# EAGLE schematic efi-shield (EAGLE 7.3.0)

## Sheet 1 of 6: CONNECTORS & SPI
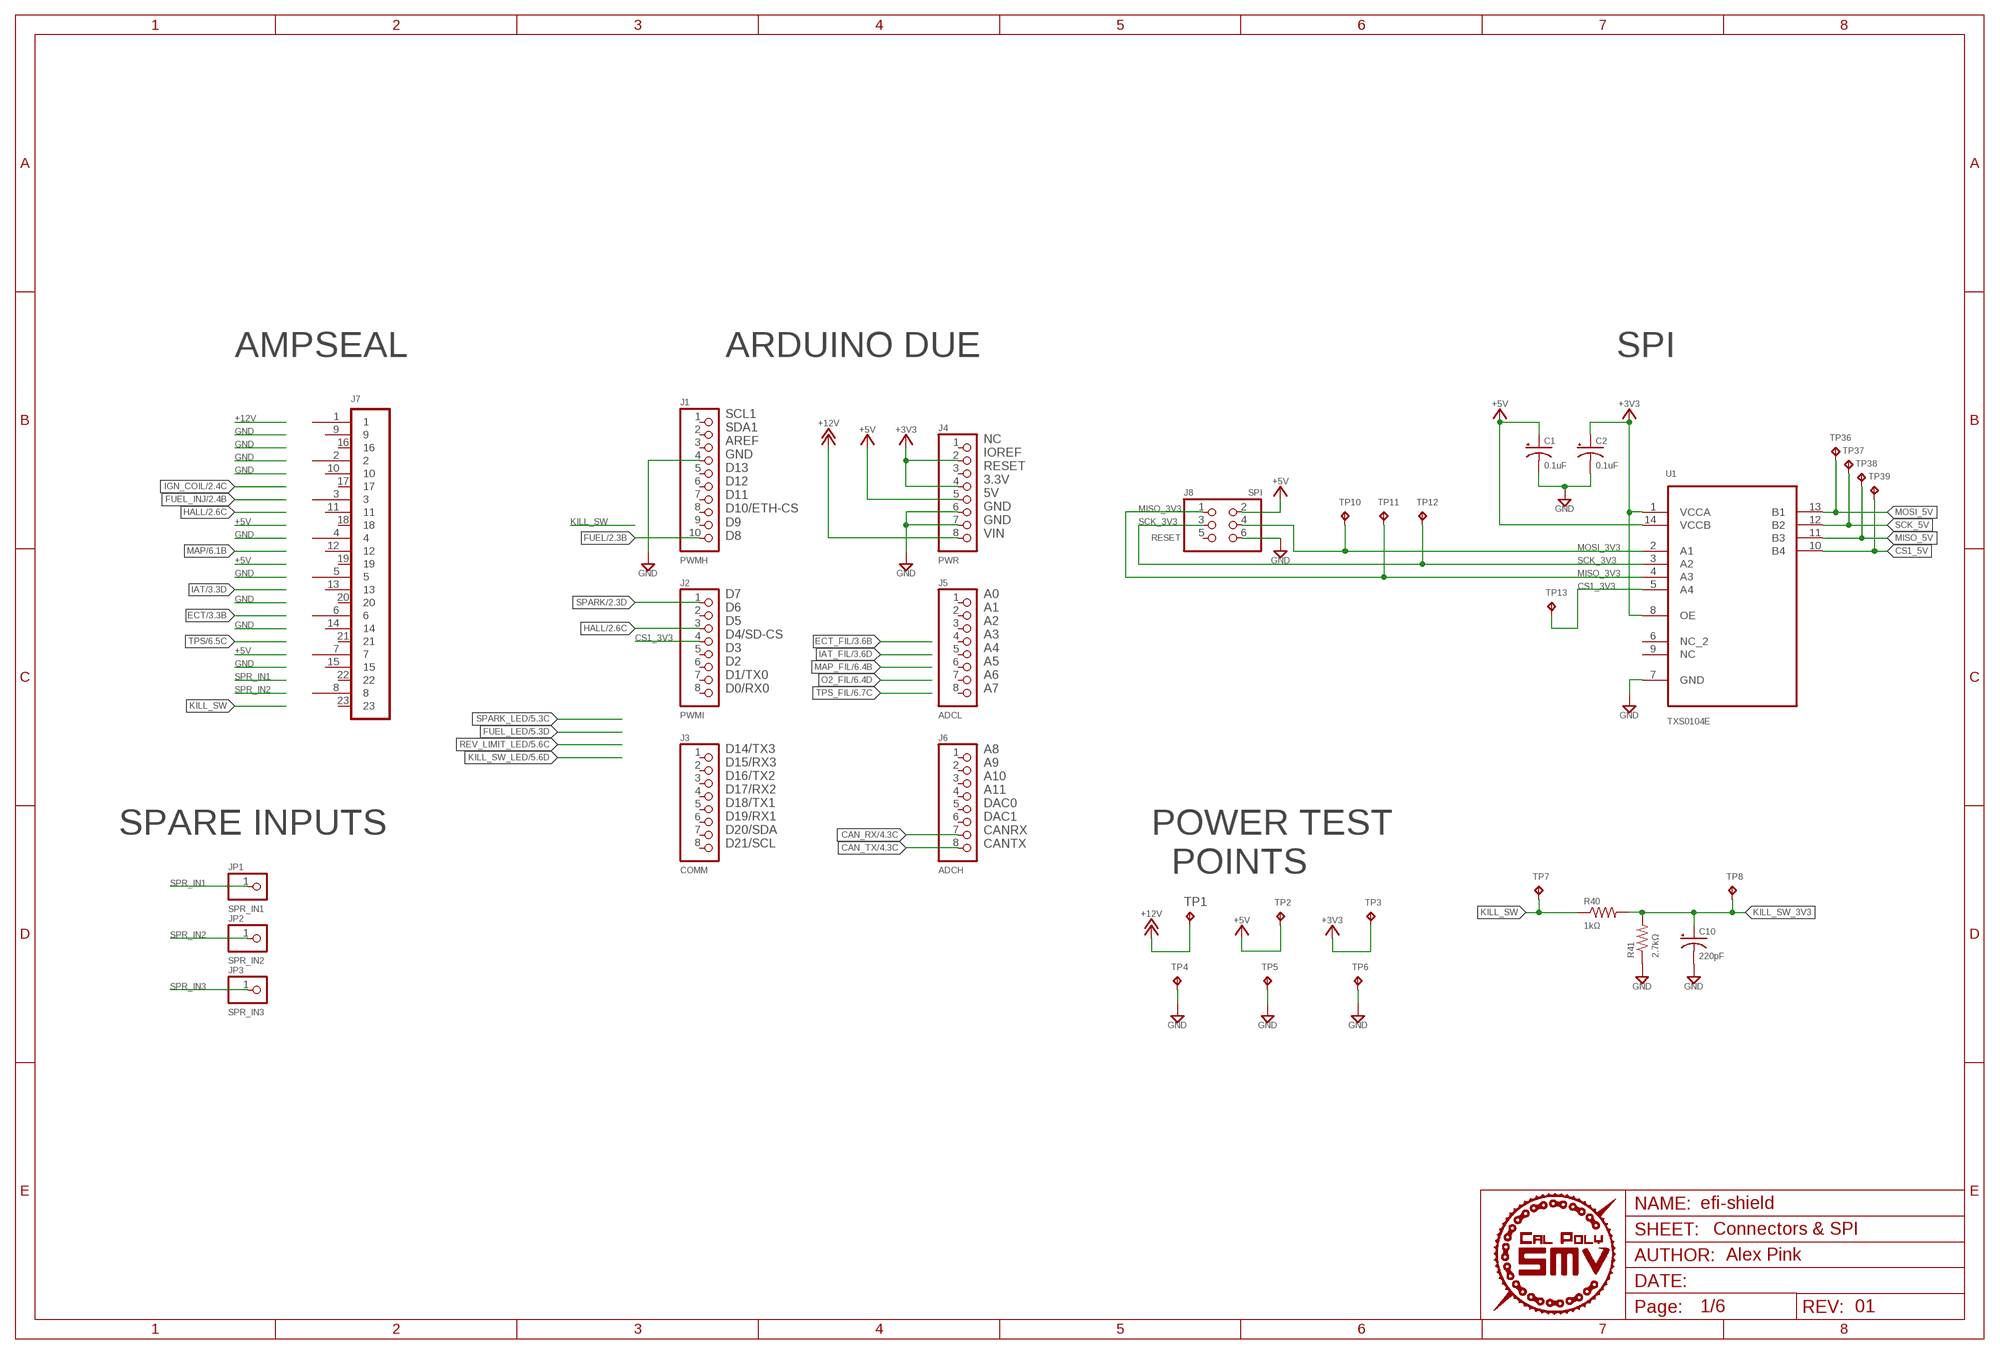
[diagram p0: schematic, sheet 1]

### Parts
C1  0.1uF  CAP-JKE  [C050-025X075]
C2  0.1uF  CAP-JKE  [C050-025X075]
C10  220pF  CAP-JKE  [C050-025X075]
J1  PWMH  PINHD-1X10  [1X10]
J2  PWMI  PINHD-1X8  [1X08]
J3  COMM  PINHD-1X8  [1X08]
J4  PWR  PINHD-1X8  [1X08]
J5  ADCL  PINHD-1X8  [1X08]
J6  ADCH  PINHD-1X8  [1X08]
J7  AMPSEAL-23POS-HEADER  [AMPSEAL-HEADER-23POS-RA]
J8  SPI  PINHD-2X3  [2X03]
JP1  SPR_IN1  PINHD-1X1  [1X01]
JP2  SPR_IN2  PINHD-1X1  [1X01]
JP3  SPR_IN3  PINHD-1X1  [1X01]
R40  1kΩ  RES-JKE  [0207/7]
R41  2.7kΩ  RES-JKE  [0207/7]
TP1  +12V  TEST-POINT  [TP-P1-20]
TP2  +5V  TEST-POINT  [TP-P1-20]
TP3  +3V3  TEST-POINT  [TP-P1-20]
TP4  GND  TEST-POINT  [TP-P1-20]
TP5  GND  TEST-POINT  [TP-P1-20]
TP6  GND  TEST-POINT  [TP-P1-20]
TP7  KILL_SW  TEST-POINT  [TP-P1-20]
TP8  KILL_SW_3V3  TEST-POINT  [TP-P1-20]
TP10  MOSI_3V3  TEST-POINT  [TP-P1-20]
TP11  MISO_3V3  TEST-POINT  [TP-P1-20]
TP12  SCK_3V3  TEST-POINT  [TP-P1-20]
TP13  CS1_3V3  TEST-POINT  [TP-P1-20]
TP36  MOSI_5V  TEST-POINT  [TP-P1-20]
TP37  SCK_5V  TEST-POINT  [TP-P1-20]
TP38  MISO_5V  TEST-POINT  [TP-P1-20]
TP39  CS1_5V  TEST-POINT  [TP-P1-20]
U1  TXS0104E  TXS0104ED  [SOIC127P600X175-14N]

### Nets
+3V3: C2.1 J4.2 J4.4 TP3.TP U1.1(VCCA) U1.8(OE)
+5V: C1.1 J4.5 J8.2 TP2.TP U1.14(VCCB) ; also sheet 2,3,4,5,6
+12V: J4.8 TP1.TP ; also sheet 4
CAN_RX: J6.7 ; also sheet 4
CAN_TX: J6.8 ; also sheet 4
CS1_3V3: J2.4 TP13.TP U1.5(A4)
CS1_5V: TP39.TP U1.10(B4)
FUEL: J1.10 ; also sheet 2
GND: C1.2 C2.2 C10.2 J1.4 J4.6 J4.7 J8.6 R41.1 TP4.TP TP5.TP TP6.TP U1.7(GND) ; also sheet 2,3,4,5,6
HALL: J2.3 ; also sheet 2
KILL_SW: R40.1 TP7.TP
KILL_SW_3V3: C10.1 R40.2 R41.2 TP8.TP
MISO_3V3: J8.1 TP11.TP U1.4(A3)
MISO_5V: TP38.TP U1.11(B3)
MOSI_3V3: J8.4 TP10.TP U1.2(A1)
MOSI_5V: TP36.TP U1.13(B1)
SCK_3V3: J8.3 TP12.TP U1.3(A2)
SCK_5V: TP37.TP U1.12(B2)
SPARK: J2.1 ; also sheet 2
SPR_IN1: JP1.1
SPR_IN2: JP2.1
SPR_IN3: JP3.1
Unconnected: J1.1 J1.2 J1.3 J1.5 J1.6 J1.7 J1.8 J1.9 J2.2 J2.5 J2.6 J2.7 J2.8 J3.1 J3.2 J3.3 J3.4 J3.5 J3.6 J3.7 J3.8 J4.1 J4.3 J5.1 J5.2 J5.3 J5.4 J5.5 J5.6 J5.7 J5.8 J6.1 J6.2 J6.3 J6.4 J6.5 J6.6 J7.1 J7.2 J7.3 J7.4 J7.5 J7.6 J7.7 J7.8 J7.9 J7.10 J7.11 J7.12 J7.13 J7.14 J7.15 J7.16 J7.17 J7.18 J7.19 J7.20 J7.21 J7.22 J7.23 J8.5 U1.6(NC_2) U1.9(NC)

### Notes on the sheet
- AMPSEAL | ARDUINO DUE | SPI
- SCL1
  SDA1
  AREF
  GND
  D13
  D12
  D11
  D10/ETH-CS
  D9
  D8
- NC
  IOREF
  RESET
  3.3V
  5V
  GND
  GND
  VIN
- RESET
- D7
  D6
  D5
  D4/SD-CS
  D3
  D2
  D1/TX0
  D0/RX0
- A0
  A1
  A2
  A3
  A4
  A5
  A6
  A7
- A8
  A9
  A10
  A11
  DAC0
  DAC1
  CANRX
  CANTX
- SPARE INPUTS
- D14/TX3
  D15/RX3
  D16/TX2
  D17/RX2
  D18/TX1
  D19/RX1
  D20/SDA
  D21/SCL
- POWER TEST
    POINTS
- Connectors & SPI
- Alex Pink
- 01

## Sheet 2 of 6: ACTUATORS + TACH
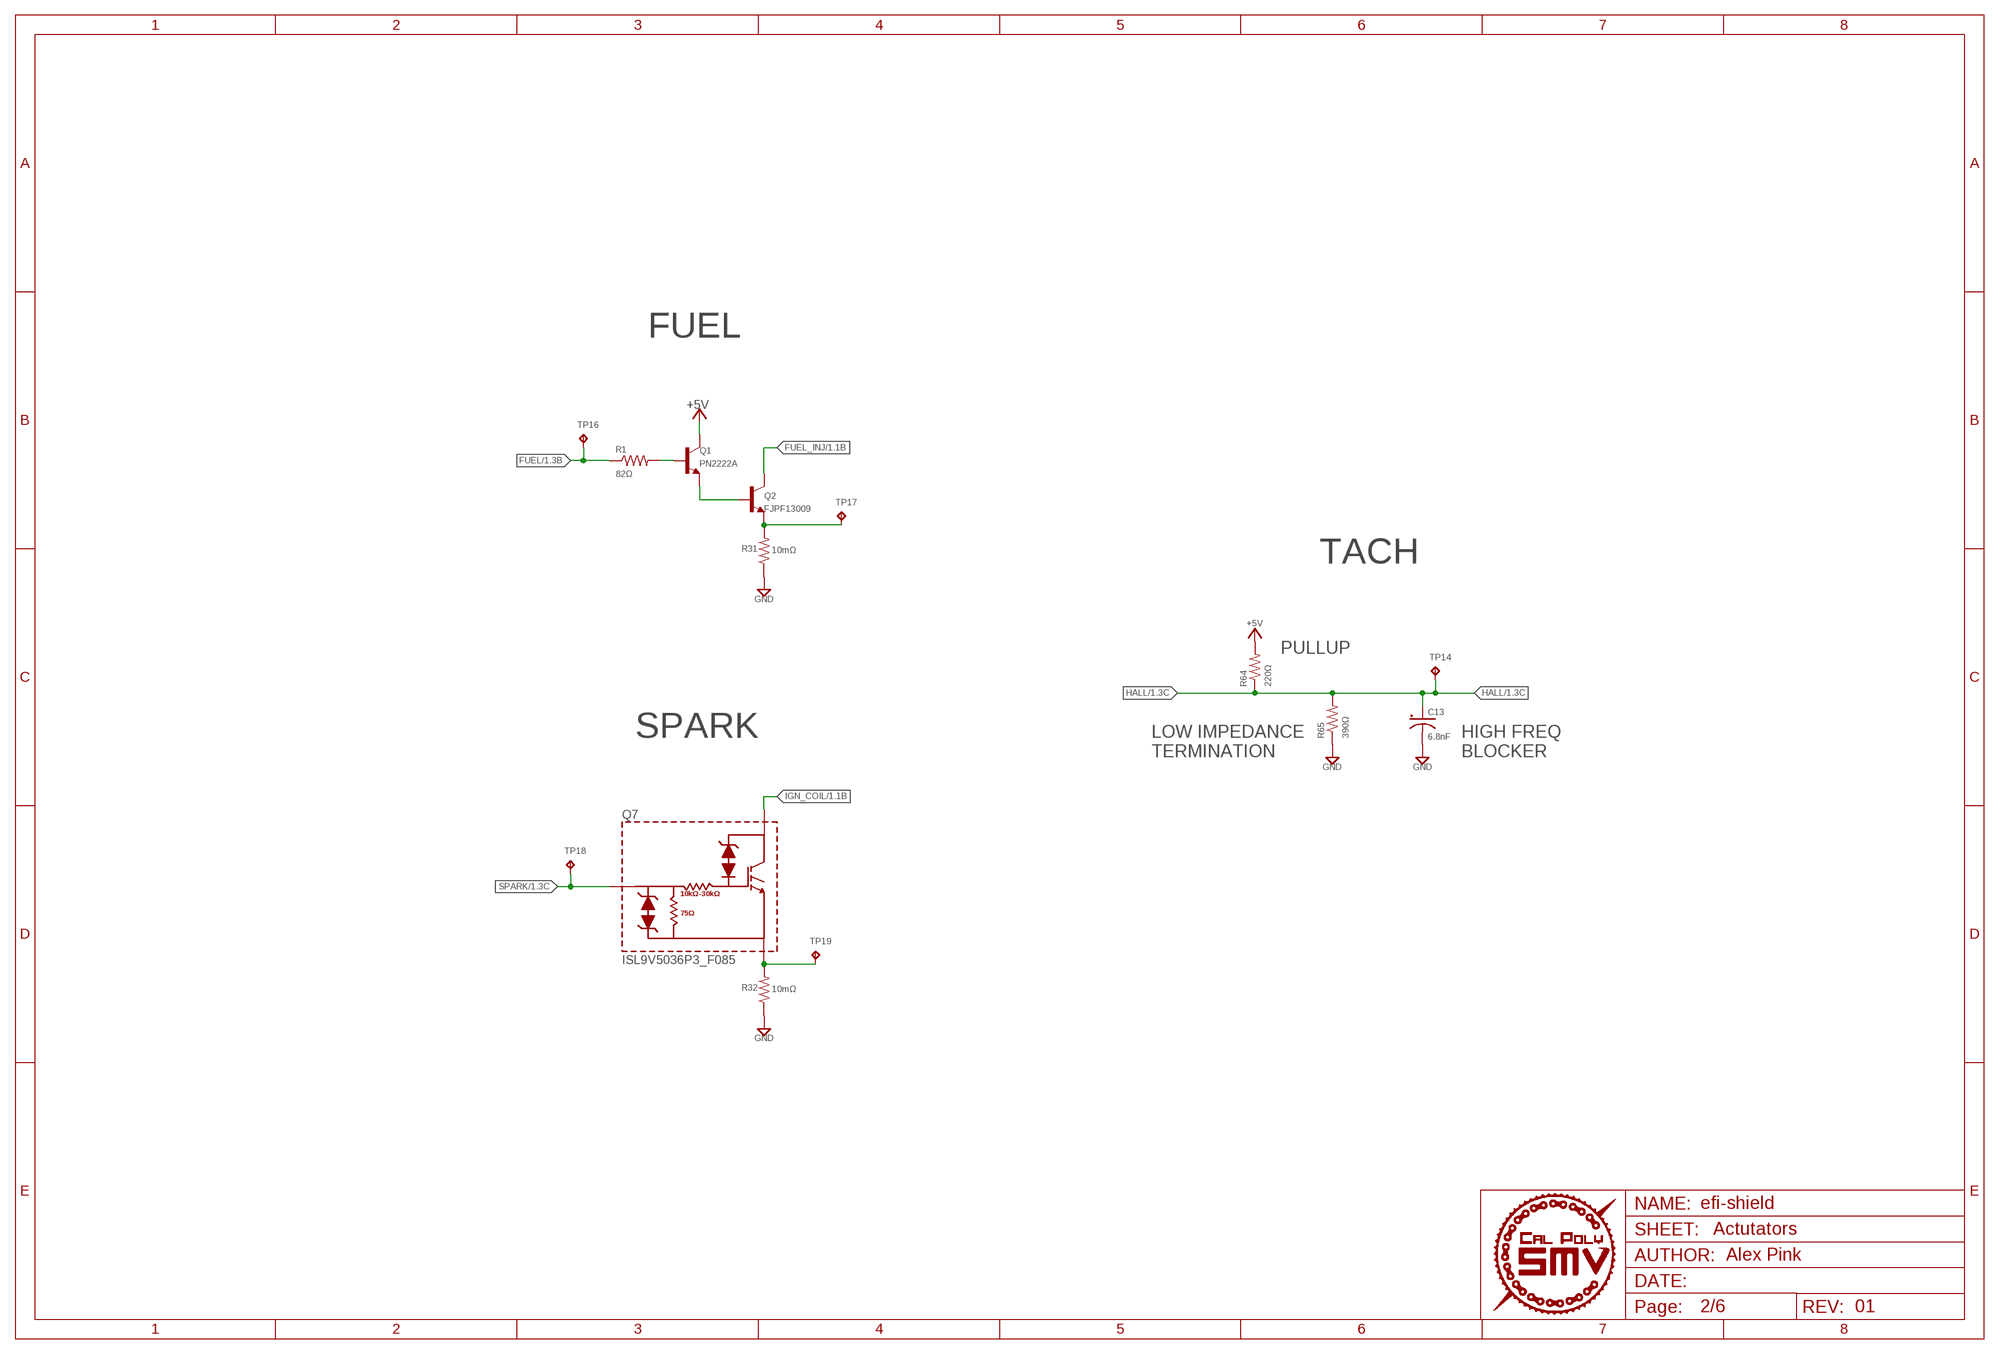
[diagram p1: schematic, sheet 2]

### Parts
C13  6.8nF  CAP-JKE  [C050-025X075]
Q1  PN2222A  [TO92-EBC]
Q2  FJPF13009  [TO220]
Q7  ISL9V5036P3_F085  [TO220AB]
R1  82Ω  RES-JKE  [0207/7]
R31  10mΩ  VISHAY_DALE-LVR03R0100FE70  [0514/15]
R32  10mΩ  VISHAY_DALE-LVR03R0100FE70  [0514/15]
R64  220Ω  RES-JKE  [0207/7]
R65  390Ω  RES-JKE  [0207/7]
TP14  HALL  TEST-POINT  [TP-P1-20]
TP16  FUEL  TEST-POINT  [TP-P1-20]
TP17  FUEL_E  TEST-POINT  [TP-P1-20]
TP18  SPARK  TEST-POINT  [TP-P1-20]
TP19  SPARK_E  TEST-POINT  [TP-P1-20]

### Nets
+5V: Q1.C R64.2 ; also sheet 1,3,4,5,6
FUEL: R1.1 TP16.TP ; also sheet 1
FUEL_INJ: Q2.2(C) ; also sheet 1
GND: C13.2 R31.1 R32.1 R65.1 ; also sheet 1,3,4,5,6
HALL: C13.1 R64.1 R65.2 TP14.TP ; also sheet 1
IGN_COIL: Q7.2(C) ; also sheet 1
N$1: Q1.B R1.2
N$3: Q1.E Q2.1(B)
N$38: Q7.3(E) R32.2 TP19.TP
N$39: Q2.3(E) R31.2 TP17.TP
SPARK: Q7.1(G) TP18.TP ; also sheet 1

### Notes on the sheet
- FUEL
- TACH
- PULLUP
- SPARK
- LOW IMPEDANCE
  TERMINATION
- HIGH FREQ
  BLOCKER
- Actutators
- Alex Pink
- 01

## Sheet 3 of 6: THERMISTORS
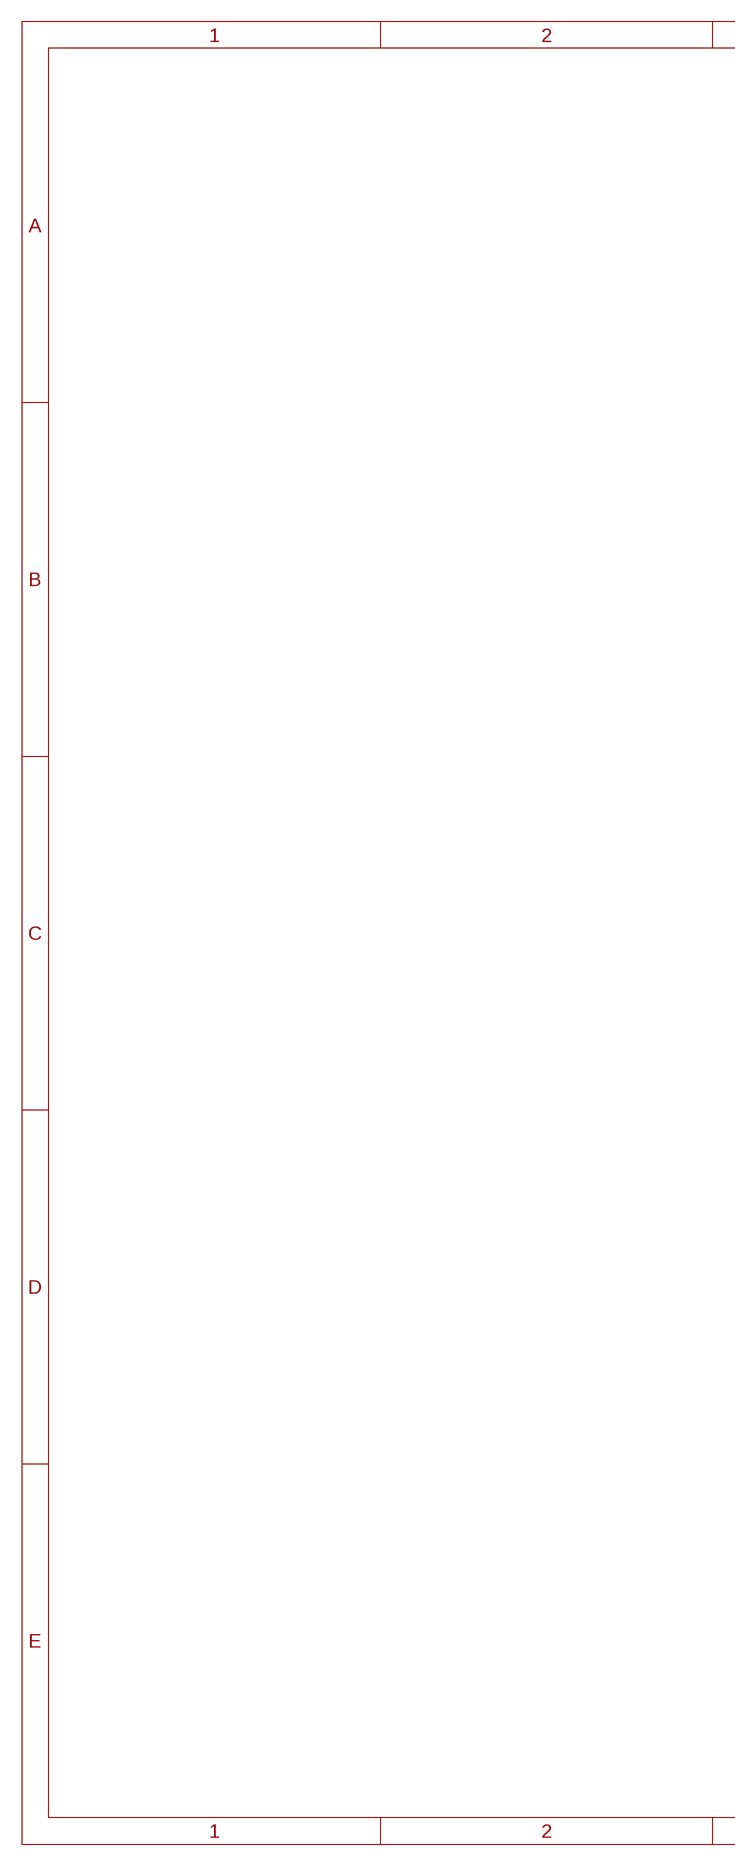
[diagram p2: schematic, sheet 3, part 1 of 2]
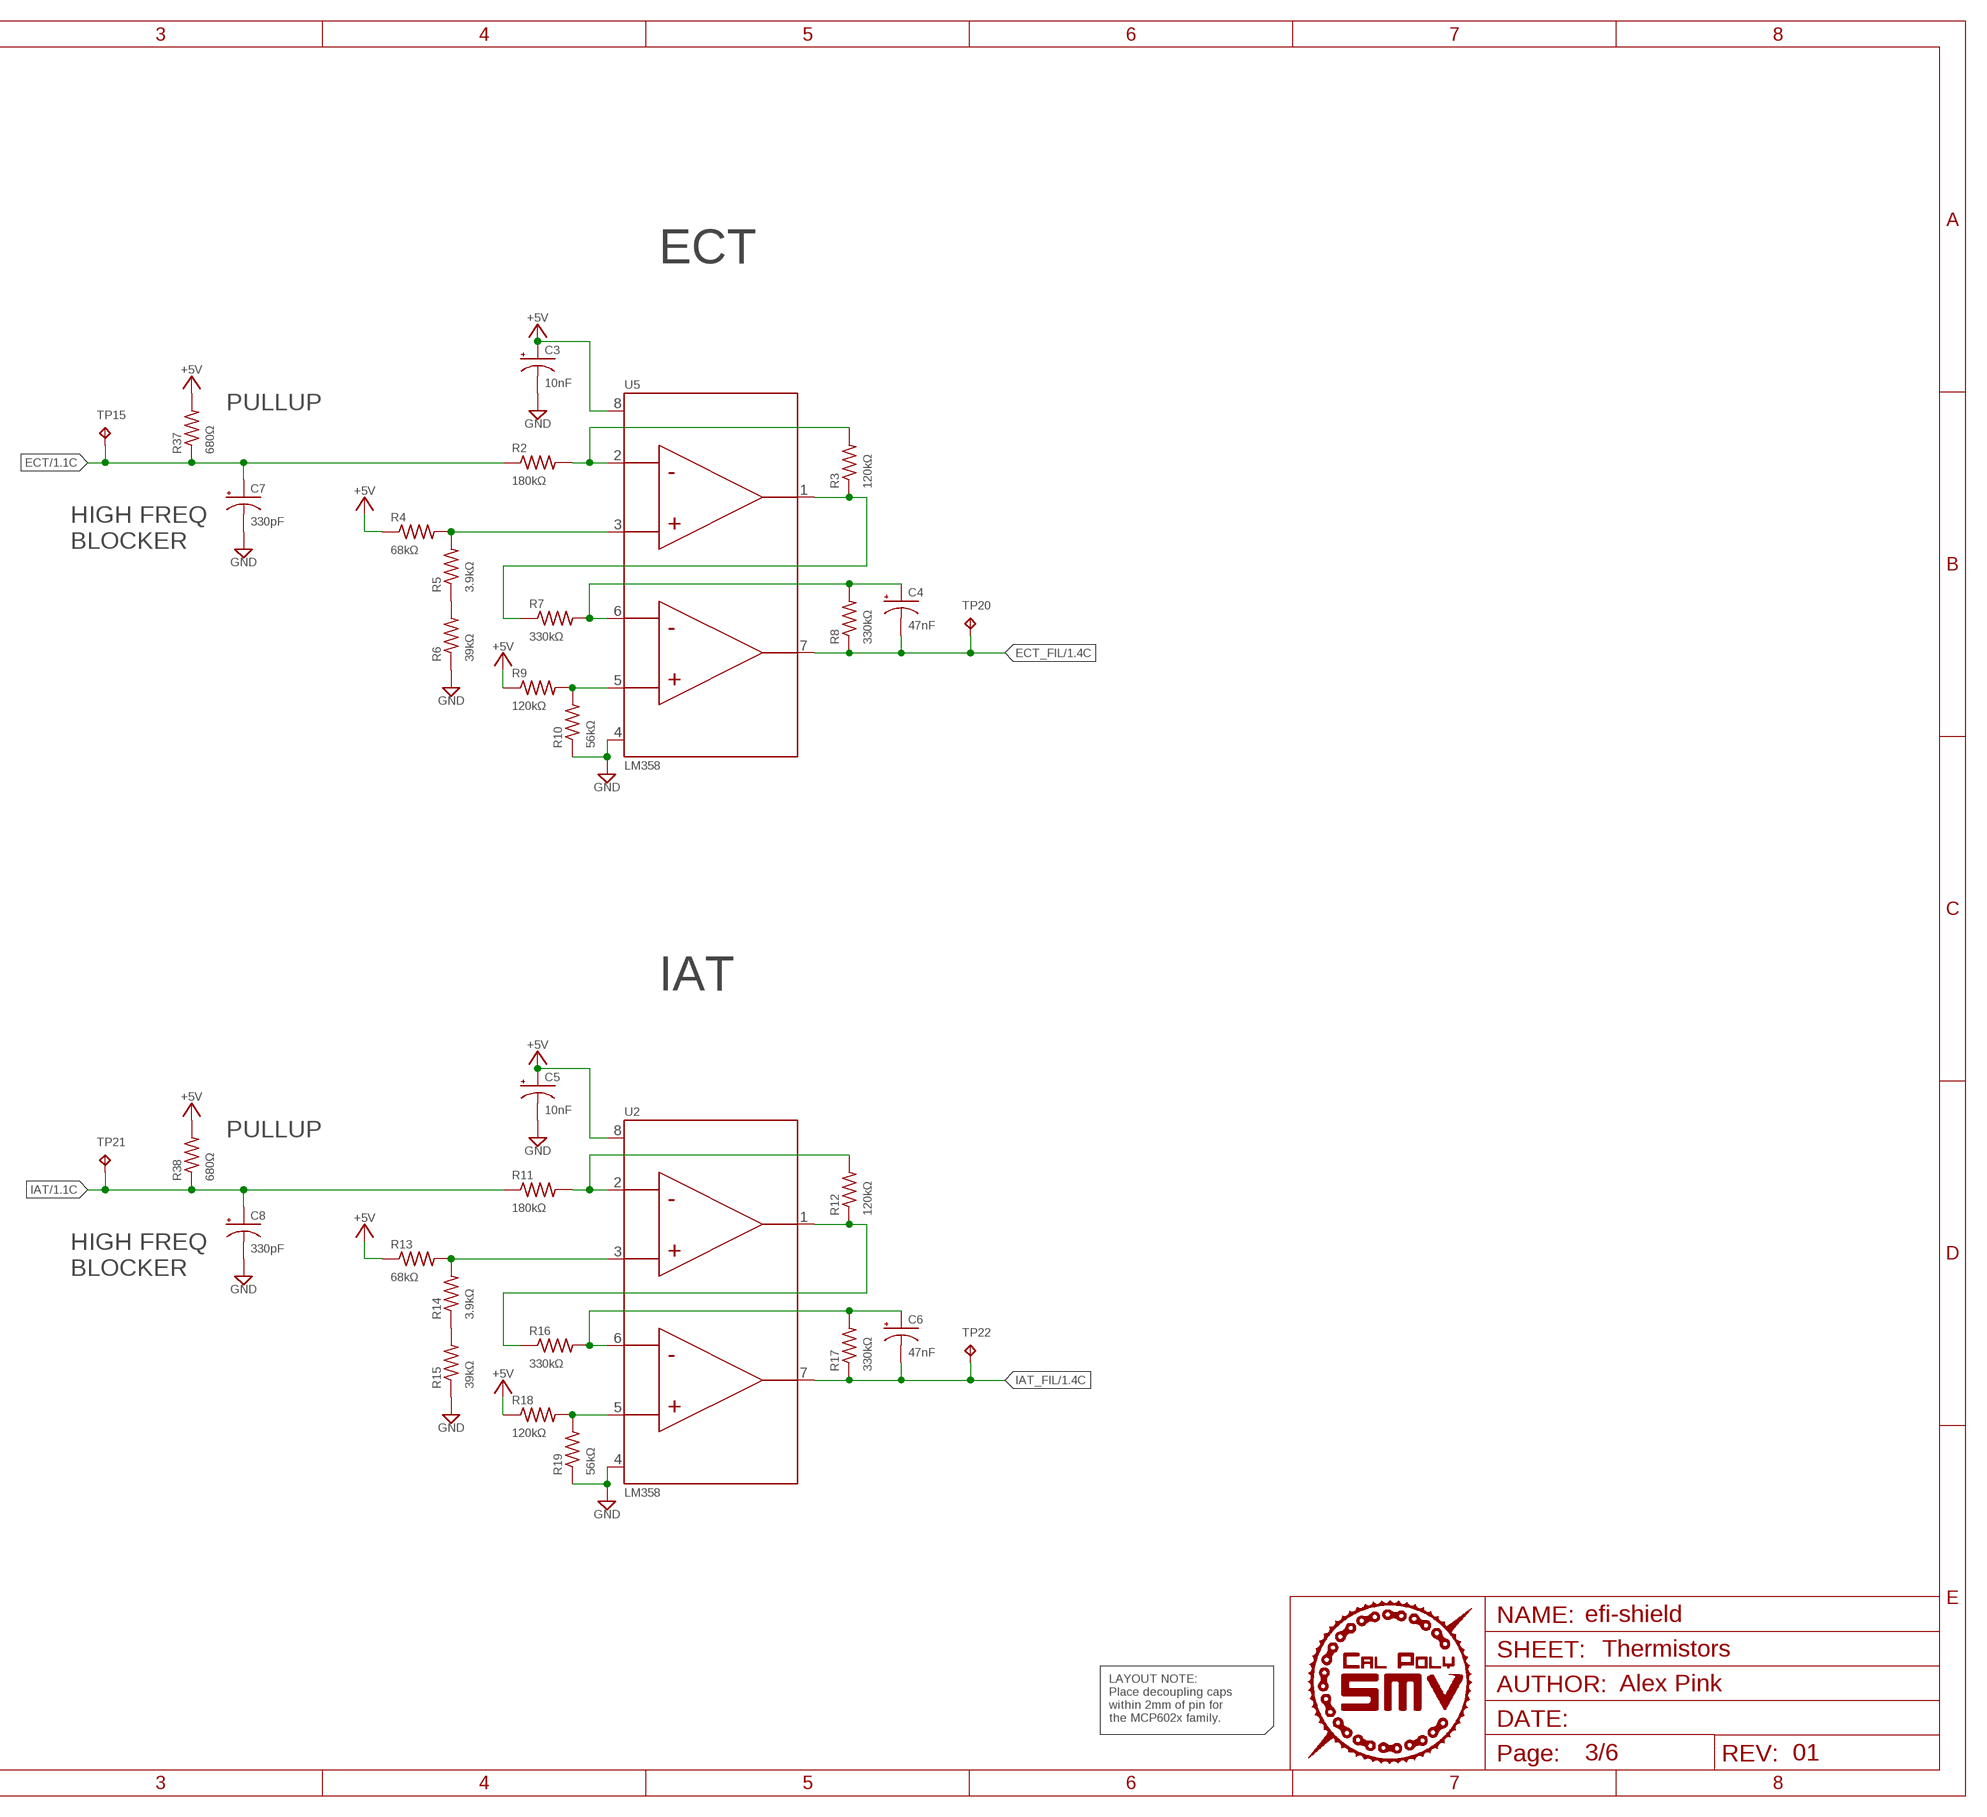
[diagram p3: schematic, sheet 3, part 2 of 2]

### Parts
C3  10nF  CAP-JKE  [C050-025X075]
C4  47nF  CAP-JKE  [C050-025X075]
C5  10nF  CAP-JKE  [C050-025X075]
C6  47nF  CAP-JKE  [C050-025X075]
C7  330pF  CAP-JKE  [C050-025X075]
C8  330pF  CAP-JKE  [C050-025X075]
R2  180kΩ  RES-JKE  [0207/7]
R3  120kΩ  RES-JKE  [0207/7]
R4  68kΩ  RES-JKE  [0207/7]
R5  3.9kΩ  RES-JKE  [0207/7]
R6  39kΩ  RES-JKE  [0207/7]
R7  330kΩ  RES-JKE  [0207/7]
R8  330kΩ  RES-JKE  [0207/7]
R9  120kΩ  RES-JKE  [0207/7]
R10  56kΩ  RES-JKE  [0207/7]
R11  180kΩ  RES-JKE  [0207/7]
R12  120kΩ  RES-JKE  [0207/7]
R13  68kΩ  RES-JKE  [0207/7]
R14  3.9kΩ  RES-JKE  [0207/7]
R15  39kΩ  RES-JKE  [0207/7]
R16  330kΩ  RES-JKE  [0207/7]
R17  330kΩ  RES-JKE  [0207/7]
R18  120kΩ  RES-JKE  [0207/7]
R19  56kΩ  RES-JKE  [0207/7]
R37  680Ω  RES-JKE  [0207/7]
R38  680Ω  RES-JKE  [0207/7]
TP15  ECT  TEST-POINT  [TP-P1-20]
TP20  ECT_FIL  TEST-POINT  [TP-P1-20]
TP21  IAT  TEST-POINT  [TP-P1-20]
TP22  IAT_FIL  TEST-POINT  [TP-P1-20]
U2  LM358  [SOP08]
U5  LM358  [SOP08]

### Nets
+5V: C3.1 C5.1 R4.1 R9.1 R13.1 R18.1 R37.2 R38.2 U2.8(VDD) U5.8(VDD) ; also sheet 1,2,4,5,6
ECT: C7.1 R2.1 R37.1 TP15.TP ; also sheet 1
ECT_FIL: C4.2 R8.1 TP20.TP U5.7(VOUTB) ; also sheet 1
GND: C3.2 C5.2 C7.2 C8.2 R6.1 R10.1 R15.1 R19.1 U2.4(VSS) U5.4(VSS) ; also sheet 1,2,4,5,6
IAT: C8.1 R11.1 R38.1 TP21.TP ; also sheet 1
IAT_FIL: C6.2 R17.1 TP22.TP U2.7(VOUTB) ; also sheet 1
N$2: R4.2 R5.2 U5.3(VINA+)
N$4: R9.2 R10.2 U5.5(VINB+)
N$5: R2.2 R3.2 U5.2(VINA-)
N$6: R3.1 R7.1 U5.1(VOUTA)
N$7: C4.1 R7.2 R8.2 U5.6(VINB-)
N$8: R13.2 R14.2 U2.3(VINA+)
N$9: R5.1 R6.2
N$10: R18.2 R19.2 U2.5(VINB+)
N$11: R11.2 R12.2 U2.2(VINA-)
N$12: R12.1 R16.1 U2.1(VOUTA)
N$13: C6.1 R16.2 R17.2 U2.6(VINB-)
N$14: R14.1 R15.2

### Notes on the sheet
- ECT
- PULLUP
- HIGH FREQ
  BLOCKER
- IAT
- PULLUP
- HIGH FREQ
  BLOCKER
- Thermistors
- LAYOUT NOTE:
  Place decoupling caps 
  within 2mm of pin for 
  the MCP602x family.
- Alex Pink
- 01

## Sheet 4 of 6: CAN
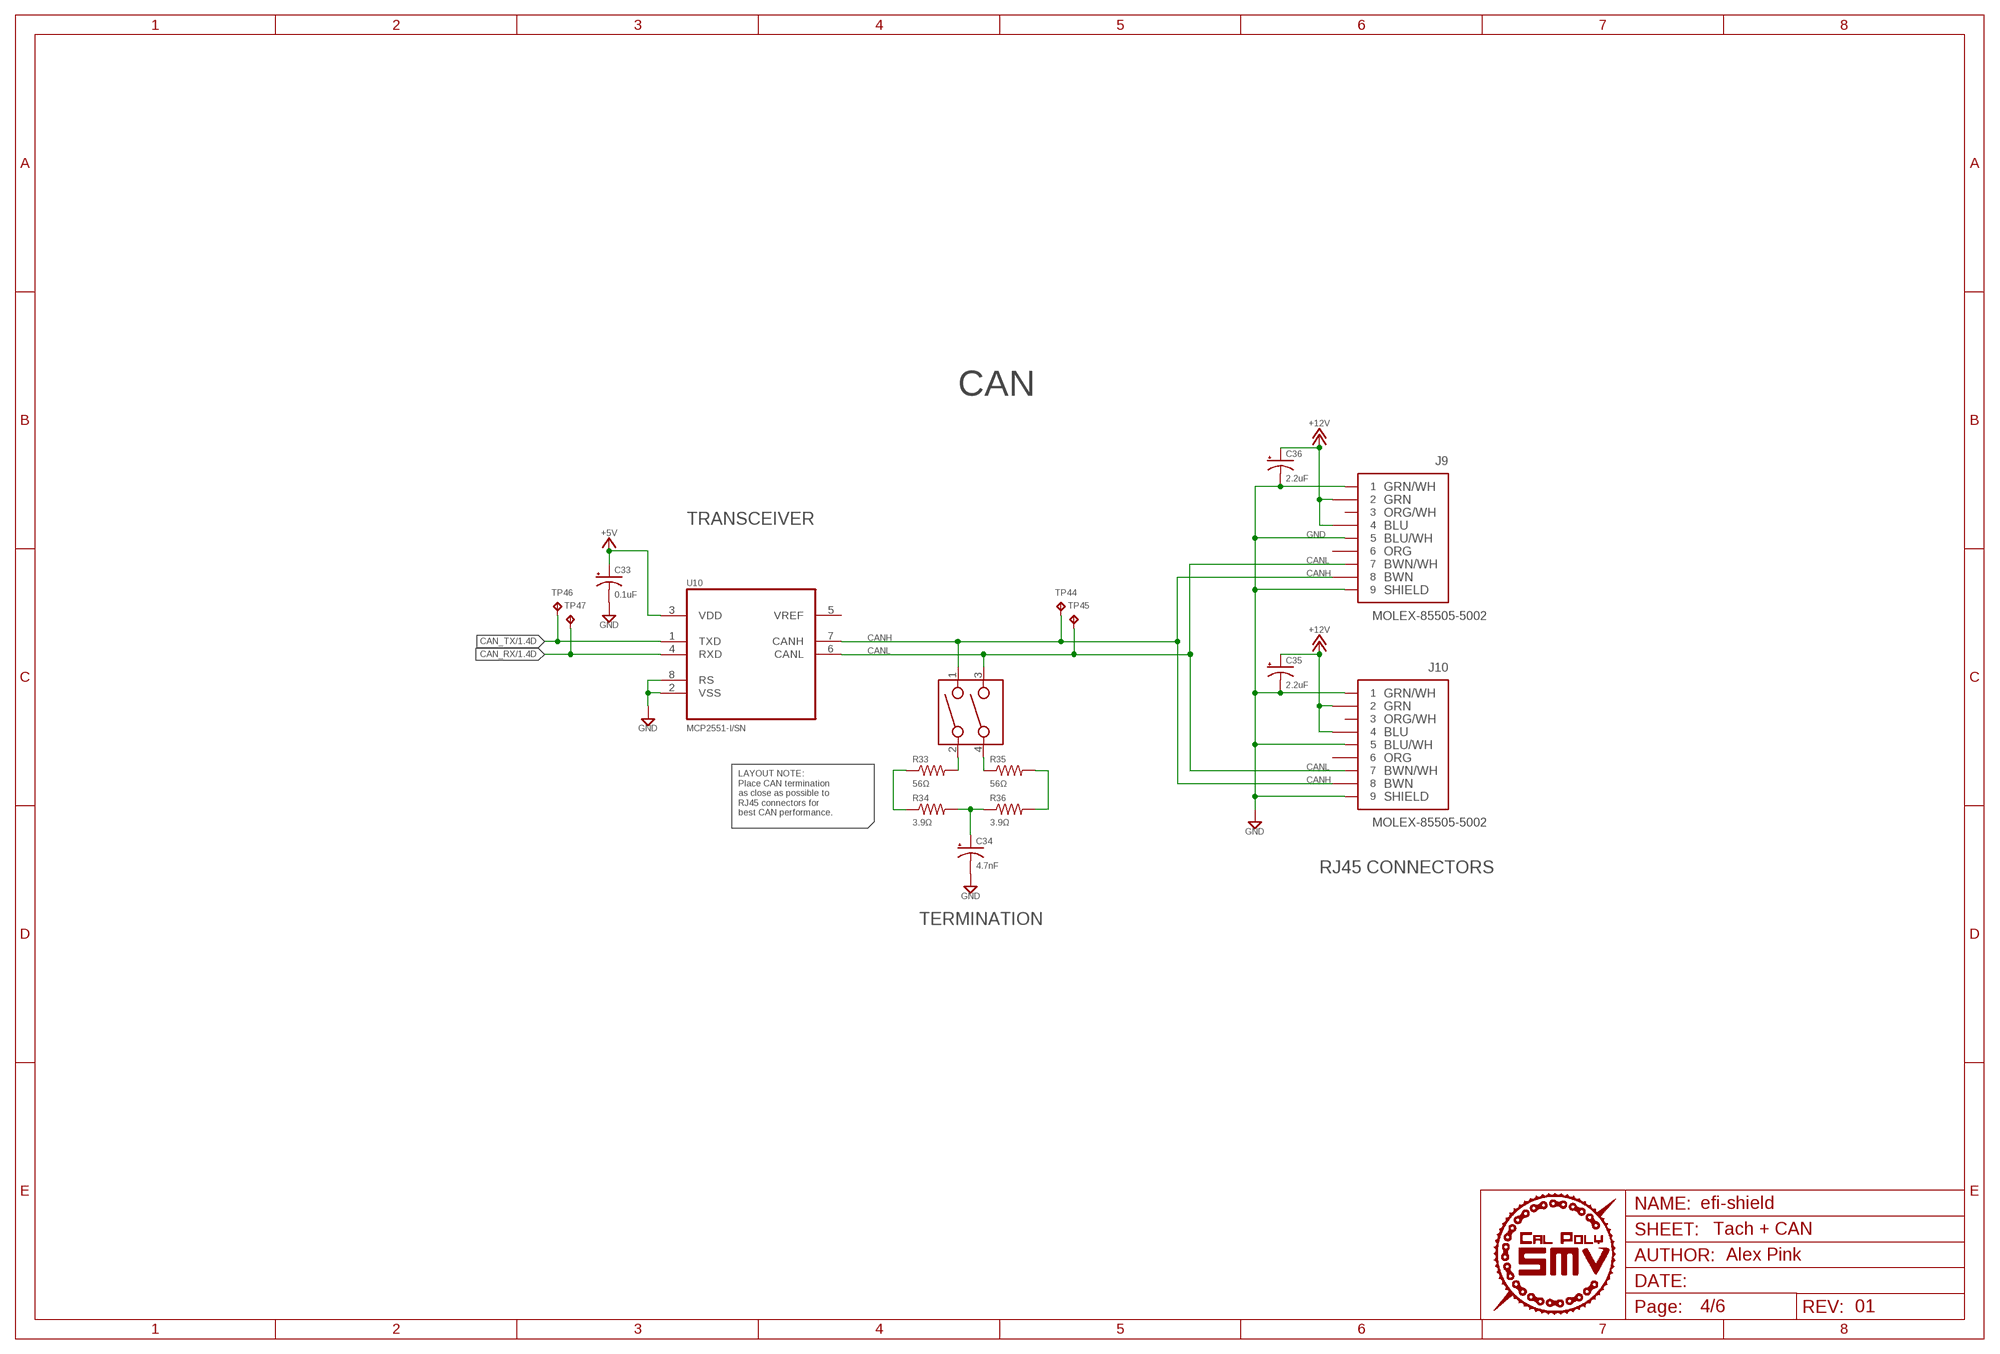
[diagram p4: schematic, sheet 4]

### Parts
C33  0.1uF  CAP-JKE  [C050-025X075]
C34  4.7nF  CAP-JKE  [C050-025X075]
C35  2.2uF  CAP-JKE  [C050-025X075]
C36  2.2uF  CAP-JKE  [C050-025X075]
J9  MOLEX-85505-5002  [85505-5002]
J10  MOLEX-85505-5002  [85505-5002]
R33  56Ω  RES-JKE  [0207/7]
R34  3.9Ω  RES-JKE  [0207/7]
R35  56Ω  RES-JKE  [0207/7]
R36  3.9Ω  RES-JKE  [0207/7]
SW1  CTS-204-211ST  [204-211ST]
TP44  CANH  TEST-POINT  [TP-P1-20]
TP45  CANL  TEST-POINT  [TP-P1-20]
TP46  CAN_TX  TEST-POINT  [TP-P1-20]
TP47  CAN_RX  TEST-POINT  [TP-P1-20]
U10  MCP2551-I/SN  [SOIC127P600X175-8N]

### Nets
+5V: C33.1 U10.3(VDD) ; also sheet 1,2,3,5,6
+12V: C35.1 C36.1 J9.2 J9.4 J10.2 J10.4 ; also sheet 1
CAN_RX: TP47.TP U10.4(RXD) ; also sheet 1
CAN_TX: TP46.TP U10.1(TXD) ; also sheet 1
CANH: J9.8 J10.8 SW1.1 TP44.TP U10.7(CANH)
CANL: J9.7 J10.7 SW1.3 TP45.TP U10.6(CANL)
GND: C33.2 C34.2 C35.2 C36.2 J9.1 J9.5 J9.9 J9.10 J10.1 J10.5 J10.9 J10.10 U10.2(VSS) U10.8(RS) ; also sheet 1,2,3,5,6
N$40: R33.2 SW1.2
N$41: R35.1 SW1.4
N$42: R33.1 R34.1
N$43: R35.2 R36.2
N$44: C34.1 R34.2 R36.1
Unconnected: J9.3 J9.6 J10.3 J10.6 U10.5(VREF)

### Notes on the sheet
- CAN
- TRANSCEIVER
- LAYOUT NOTE:
  Place CAN termination
  as close as possible to
  RJ45 connectors for 
  best CAN performance.
- RJ45 CONNECTORS
- TERMINATION
- Tach + CAN
- Alex Pink
- 01

## Sheet 5 of 6: LEDs
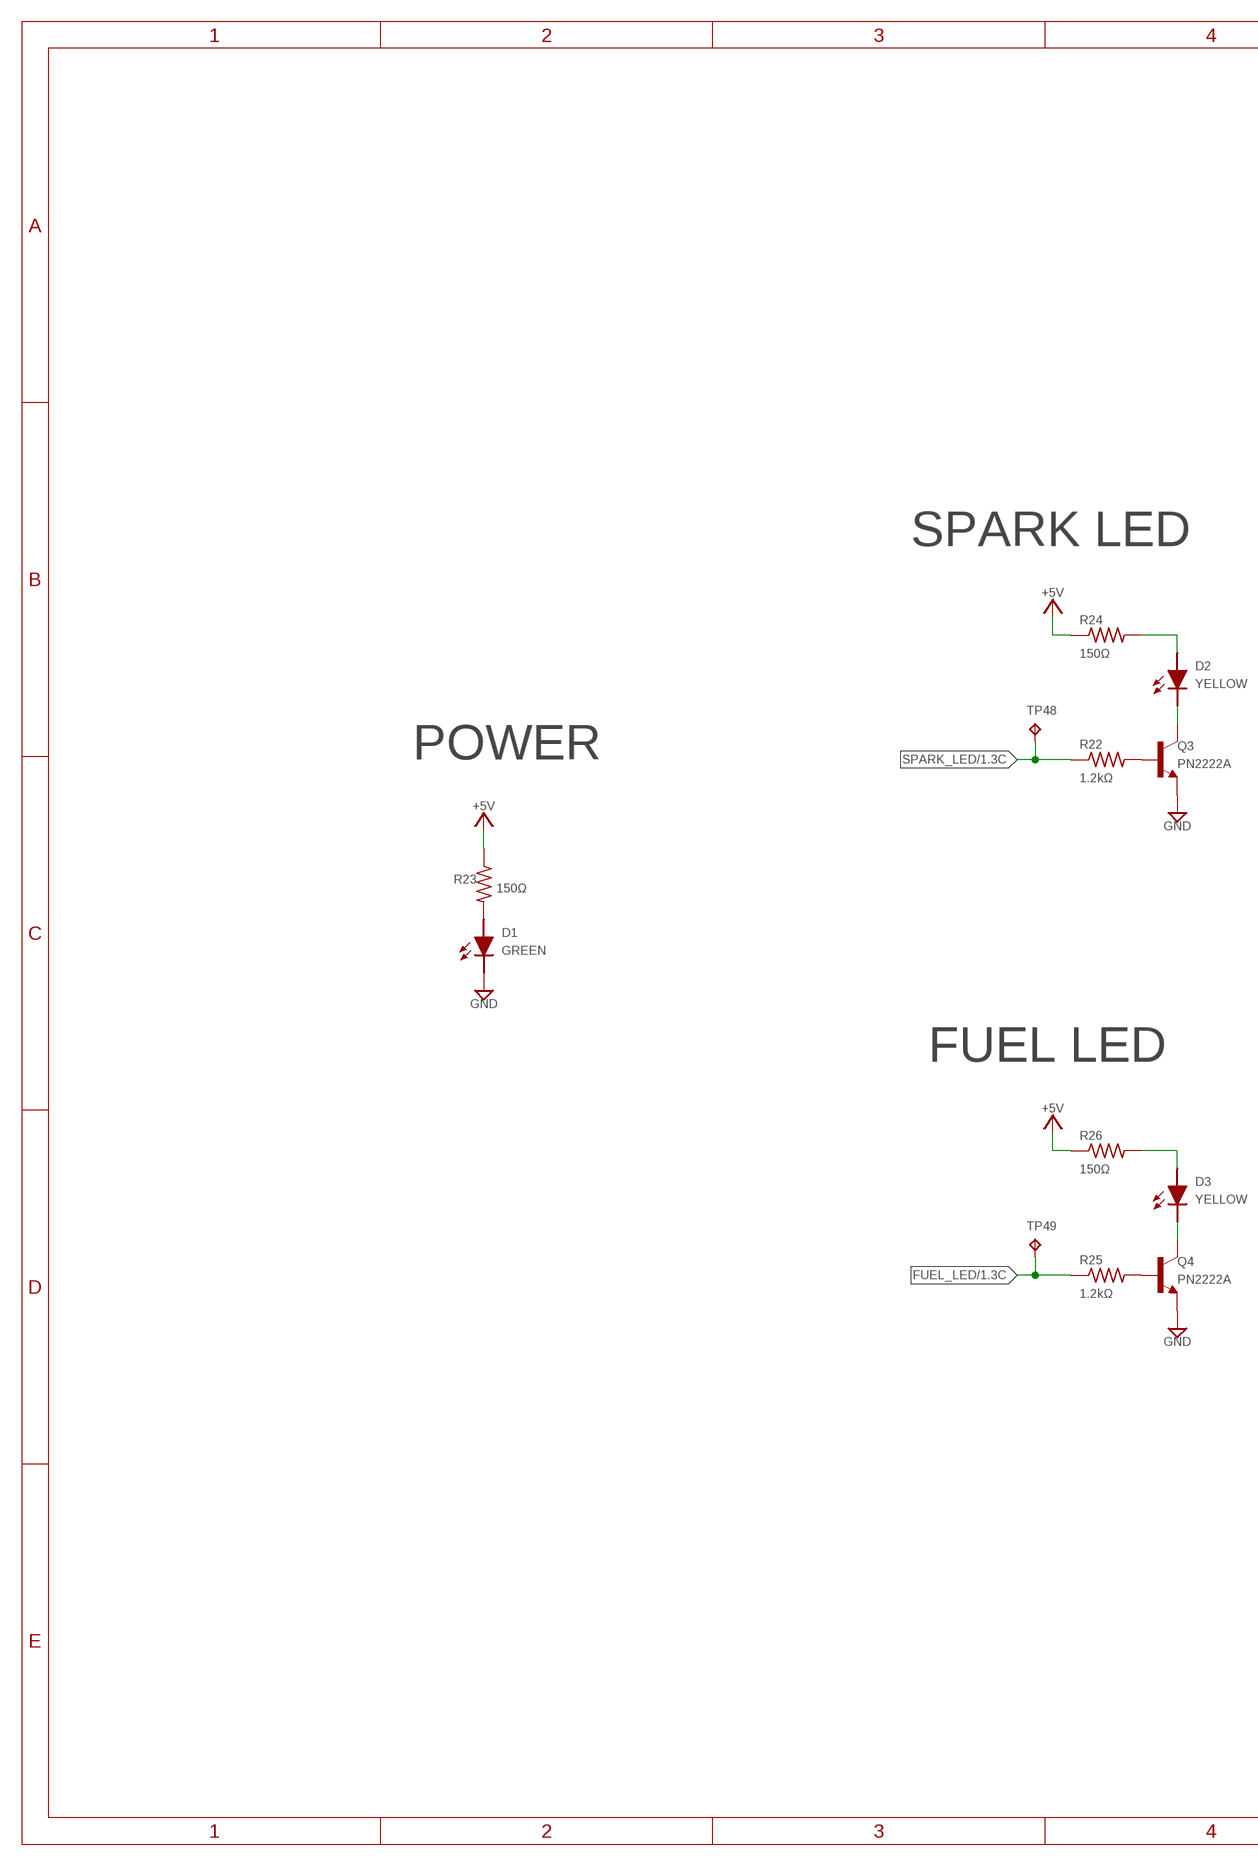
[diagram p5: schematic, sheet 5, part 1 of 2]
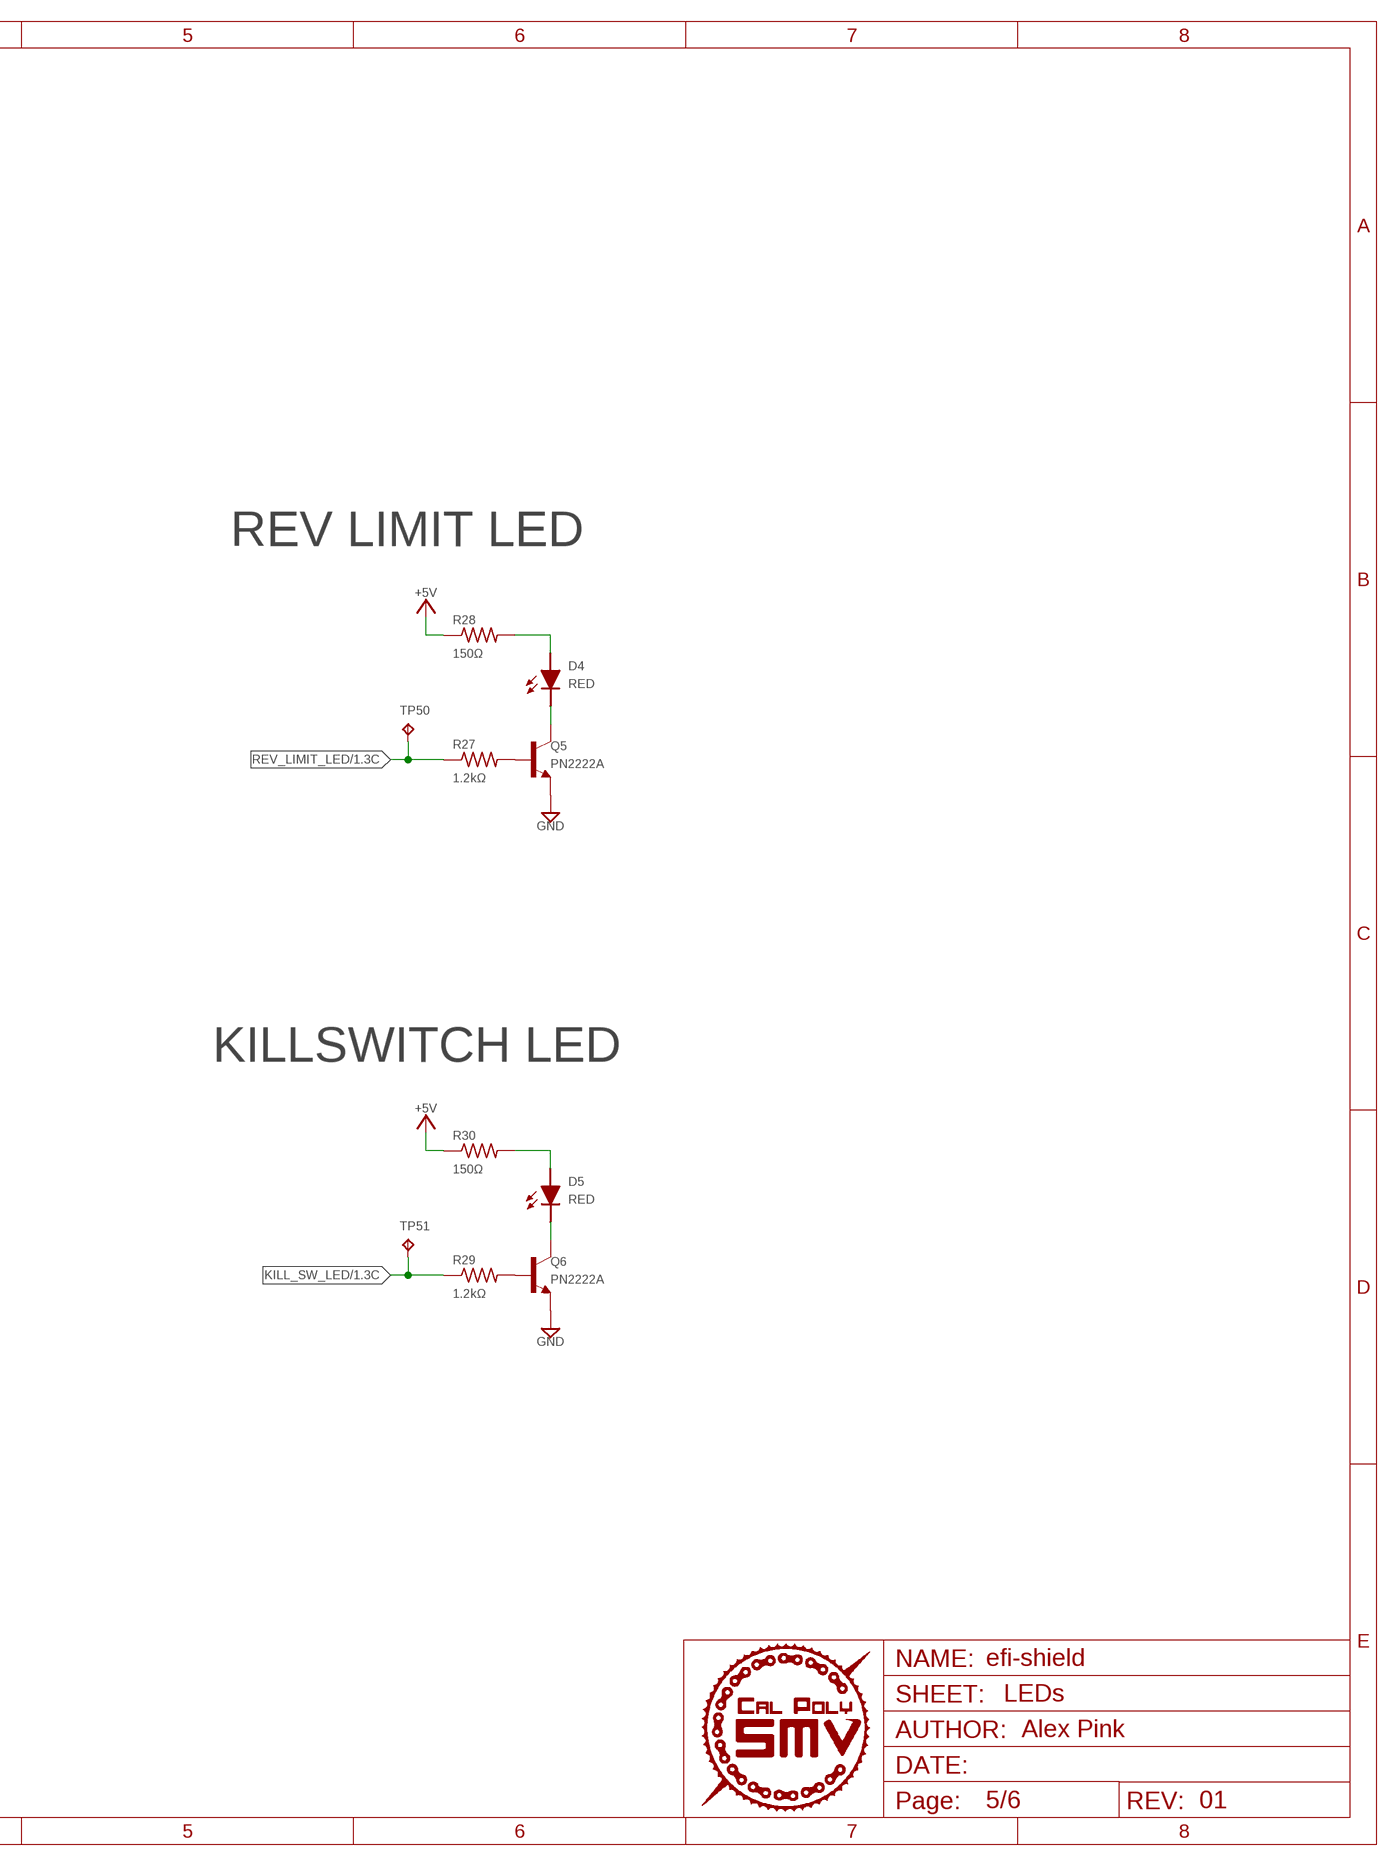
[diagram p6: schematic, sheet 5, part 2 of 2]

### Parts
D1  GREEN  LTL-533-11  [LED,THRU-HOLE,R/A]
D2  YELLOW  LTL-553-11  [LED,THRU-HOLE,R/A]
D3  YELLOW  LTL-553-11  [LED,THRU-HOLE,R/A]
D4  RED  LTL-523-11  [LED,THRU-HOLE,R/A]
D5  RED  LTL-523-11  [LED,THRU-HOLE,R/A]
Q3  PN2222A  [TO92-EBC]
Q4  PN2222A  [TO92-EBC]
Q5  PN2222A  [TO92-EBC]
Q6  PN2222A  [TO92-EBC]
R22  1.2kΩ  RES-JKE  [0207/7]
R23  150Ω  RES-JKE  [0207/7]
R24  150Ω  RES-JKE  [0207/7]
R25  1.2kΩ  RES-JKE  [0207/7]
R26  150Ω  RES-JKE  [0207/7]
R27  1.2kΩ  RES-JKE  [0207/7]
R28  150Ω  RES-JKE  [0207/7]
R29  1.2kΩ  RES-JKE  [0207/7]
R30  150Ω  RES-JKE  [0207/7]
TP48  SPARK_LED  TEST-POINT  [TP-P1-20]
TP49  FUEL_LED  TEST-POINT  [TP-P1-20]
TP50  REV_LIMIT_LED  TEST-POINT  [TP-P1-20]
TP51  KILL_SW_LED  TEST-POINT  [TP-P1-20]

### Nets
+5V: R23.1 R24.1 R26.1 R28.1 R30.1 ; also sheet 1,2,3,4,6
FUEL_LED: R25.1 TP49.TP ; also sheet 1
GND: D1.CATHODE Q3.E Q4.E Q5.E Q6.E ; also sheet 1,2,3,4,6
KILL_SW_LED: R29.1 TP51.TP ; also sheet 1
N$25: D2.CATHODE Q3.C
N$26: D2.ANODE R24.2
N$27: D1.ANODE R23.2
N$28: Q3.B R22.2
N$29: D3.CATHODE Q4.C
N$30: D3.ANODE R26.2
N$31: Q4.B R25.2
N$32: D4.CATHODE Q5.C
N$33: D4.ANODE R28.2
N$34: Q5.B R27.2
N$35: D5.CATHODE Q6.C
N$36: D5.ANODE R30.2
N$37: Q6.B R29.2
REV_LIMIT_LED: R27.1 TP50.TP ; also sheet 1
SPARK_LED: R22.1 TP48.TP ; also sheet 1

### Notes on the sheet
- SPARK LED | REV LIMIT LED
- POWER
- FUEL LED | KILLSWITCH LED
- LEDs
- Alex Pink
- 01

## Sheet 6 of 6: ANALOG
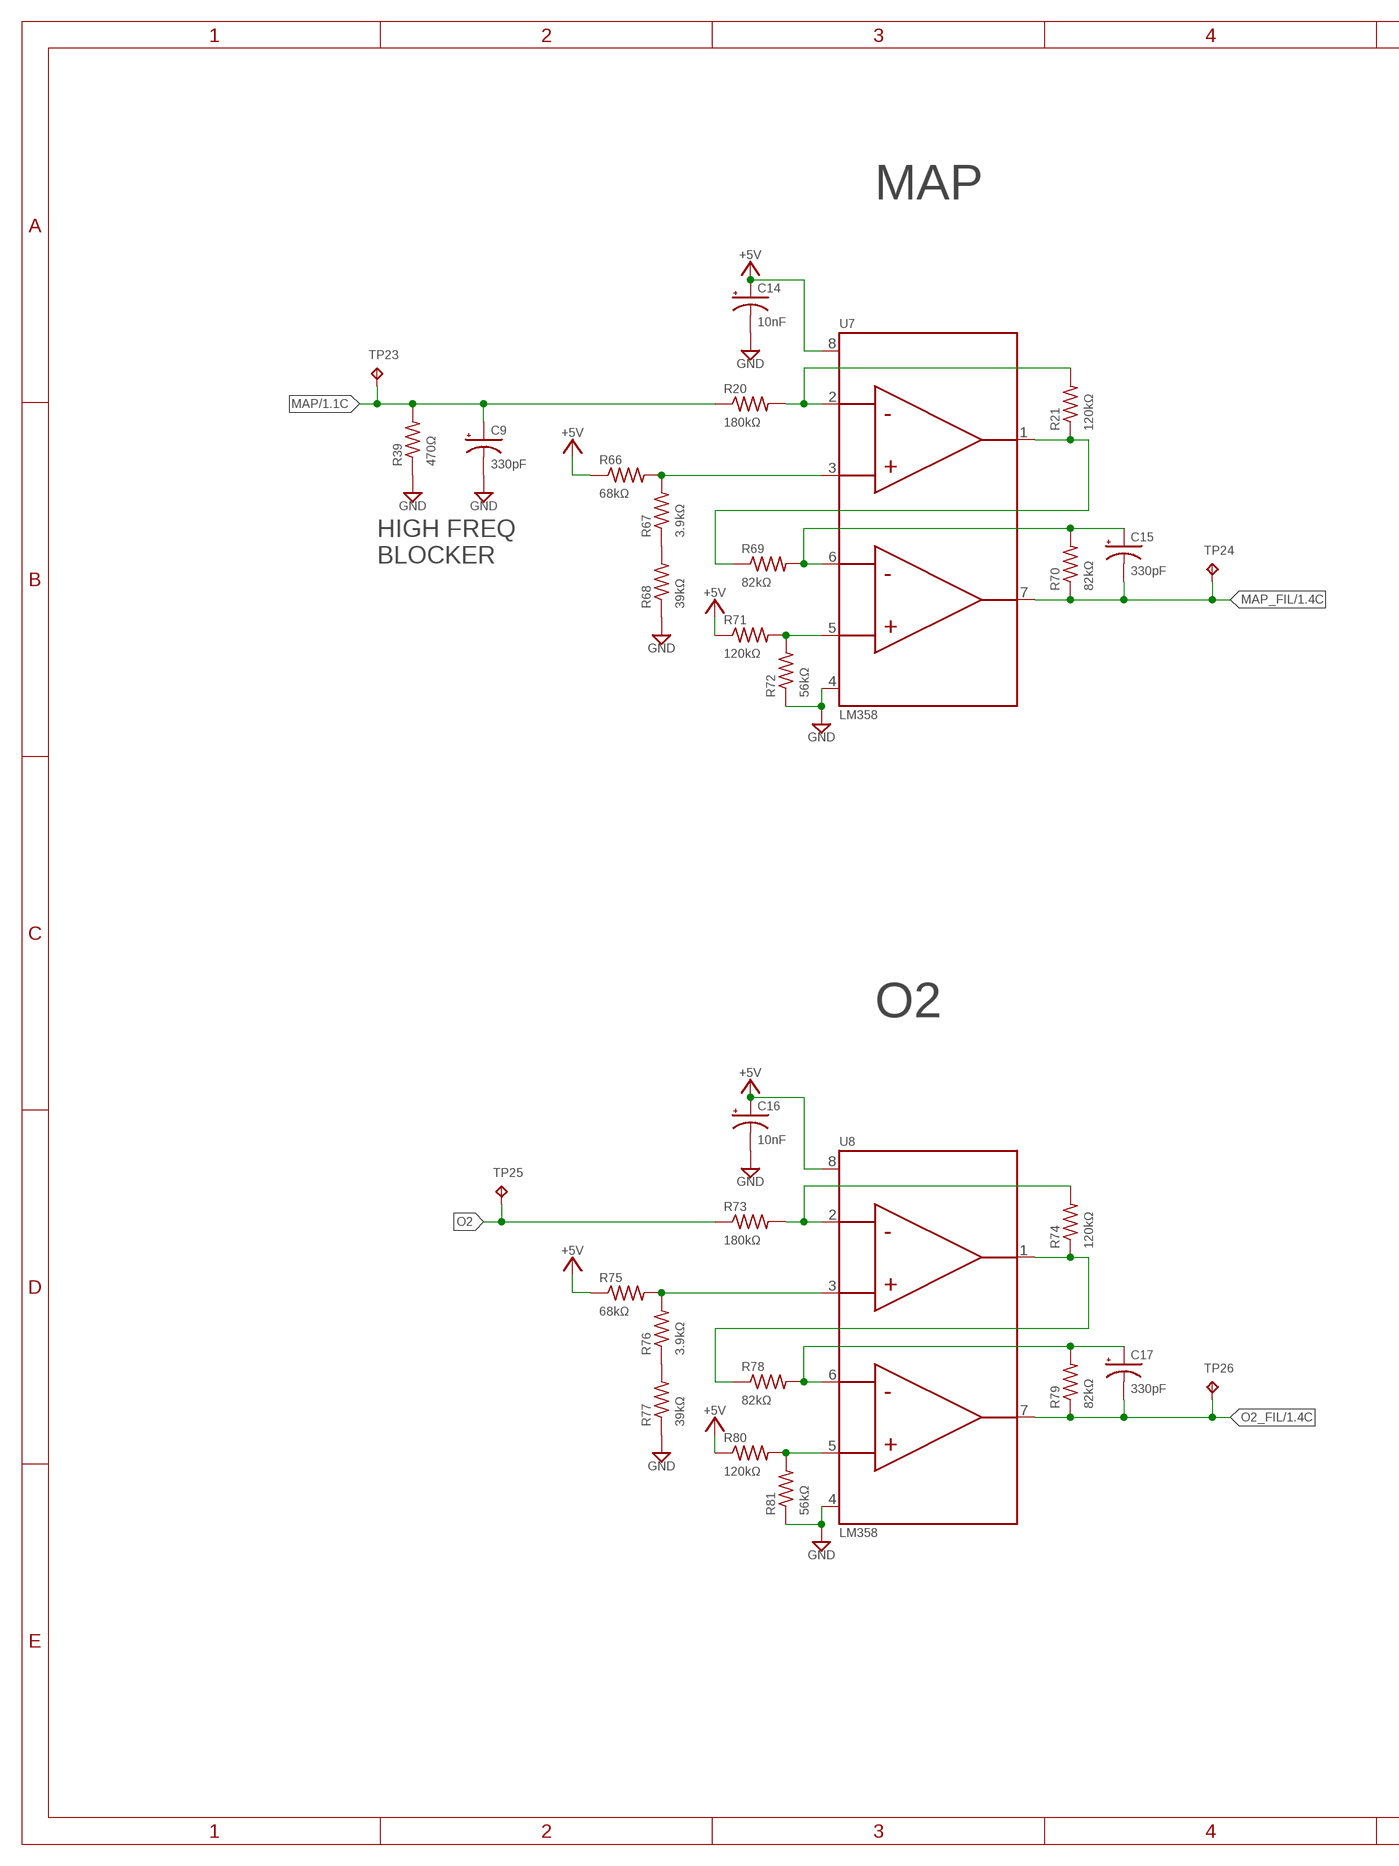
[diagram p7: schematic, sheet 6, part 1 of 2]
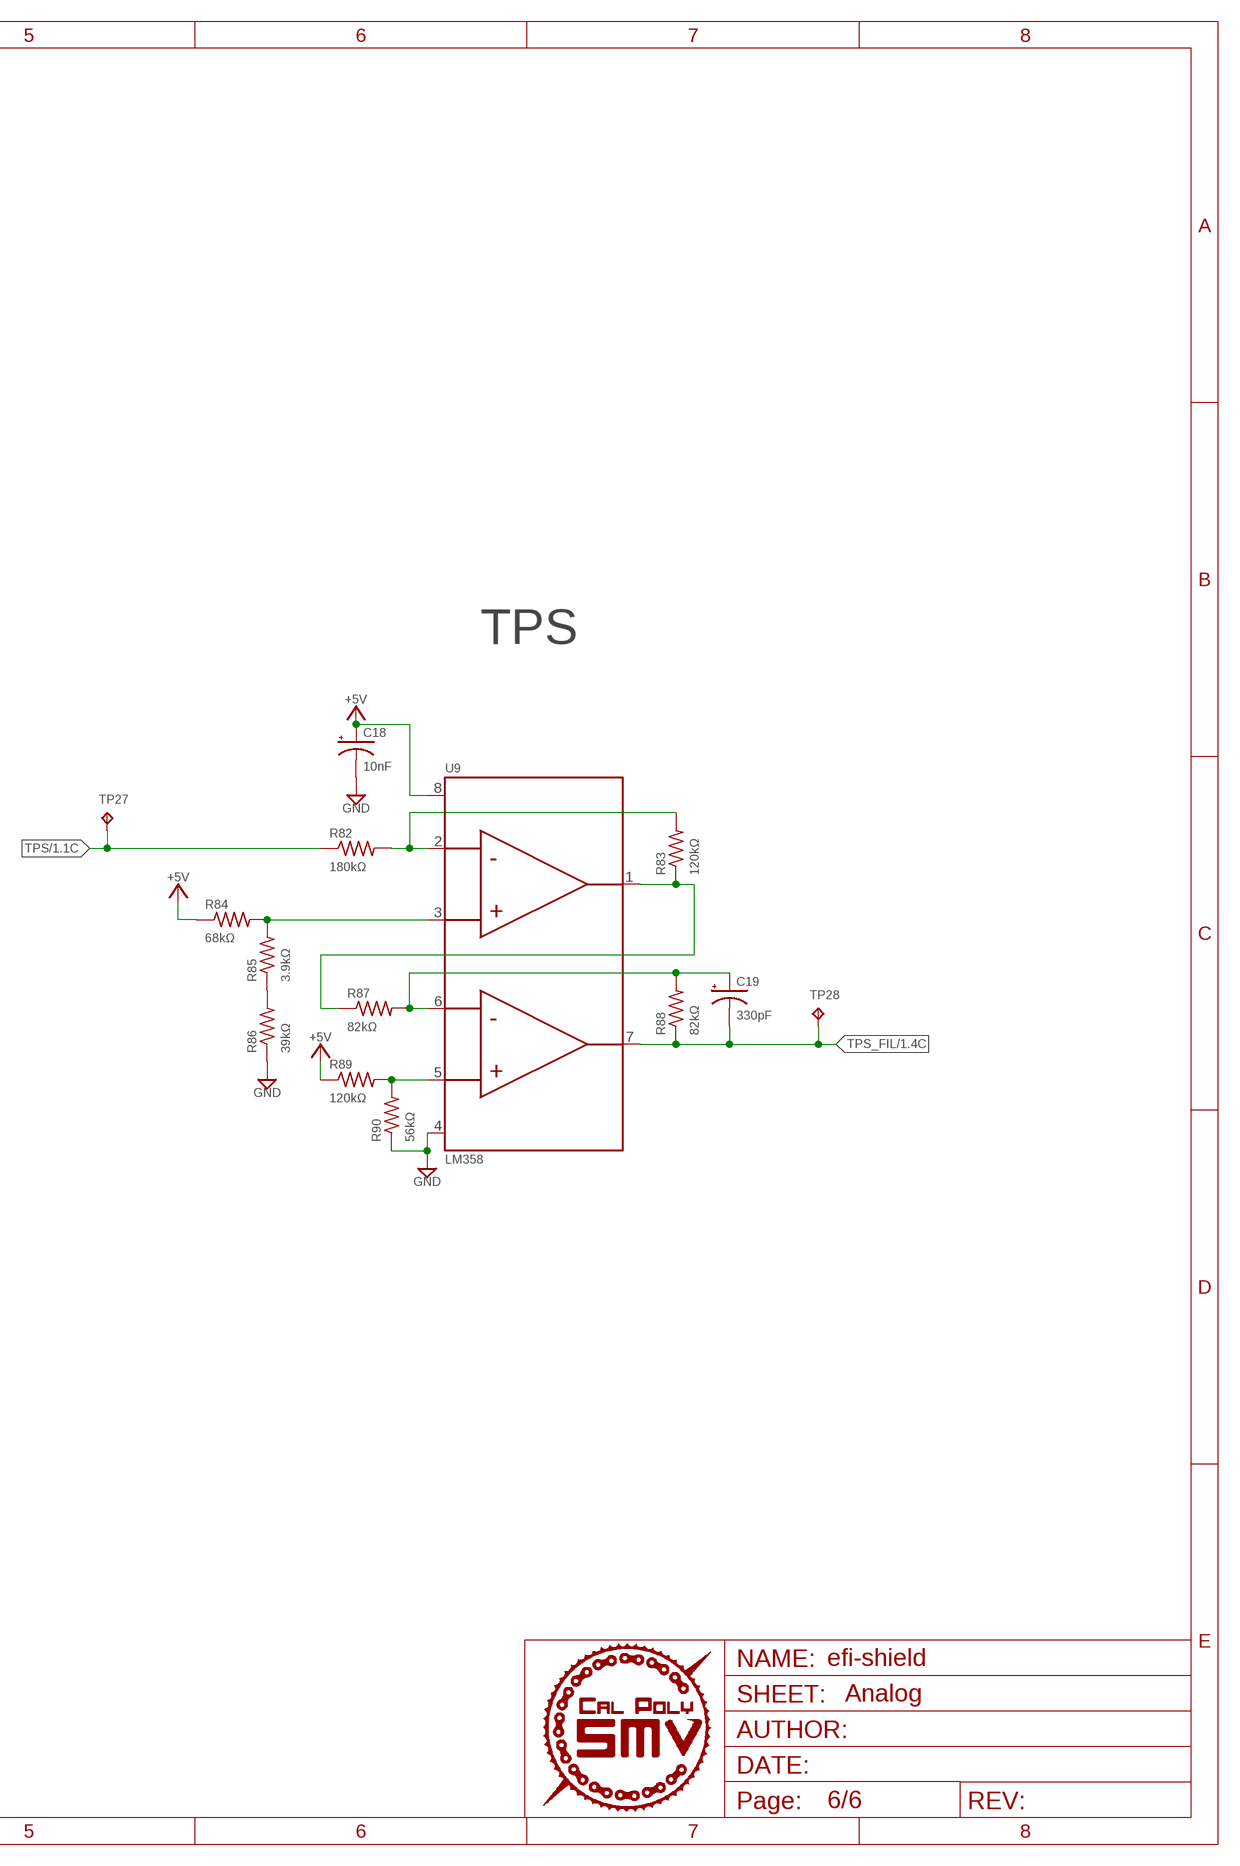
[diagram p8: schematic, sheet 6, part 2 of 2]

### Parts
C9  330pF  CAP-JKE  [C050-025X075]
C14  10nF  CAP-JKE  [C050-025X075]
C15  330pF  CAP-JKE  [C050-025X075]
C16  10nF  CAP-JKE  [C050-025X075]
C17  330pF  CAP-JKE  [C050-025X075]
C18  10nF  CAP-JKE  [C050-025X075]
C19  330pF  CAP-JKE  [C050-025X075]
R20  180kΩ  RES-JKE  [0207/7]
R21  120kΩ  RES-JKE  [0207/7]
R39  470Ω  RES-JKE  [0207/7]
R66  68kΩ  RES-JKE  [0207/7]
R67  3.9kΩ  RES-JKE  [0207/7]
R68  39kΩ  RES-JKE  [0207/7]
R69  82kΩ  RES-JKE  [0207/7]
R70  82kΩ  RES-JKE  [0207/7]
R71  120kΩ  RES-JKE  [0207/7]
R72  56kΩ  RES-JKE  [0207/7]
R73  180kΩ  RES-JKE  [0207/7]
R74  120kΩ  RES-JKE  [0207/7]
R75  68kΩ  RES-JKE  [0207/7]
R76  3.9kΩ  RES-JKE  [0207/7]
R77  39kΩ  RES-JKE  [0207/7]
R78  82kΩ  RES-JKE  [0207/7]
R79  82kΩ  RES-JKE  [0207/7]
R80  120kΩ  RES-JKE  [0207/7]
R81  56kΩ  RES-JKE  [0207/7]
R82  180kΩ  RES-JKE  [0207/7]
R83  120kΩ  RES-JKE  [0207/7]
R84  68kΩ  RES-JKE  [0207/7]
R85  3.9kΩ  RES-JKE  [0207/7]
R86  39kΩ  RES-JKE  [0207/7]
R87  82kΩ  RES-JKE  [0207/7]
R88  82kΩ  RES-JKE  [0207/7]
R89  120kΩ  RES-JKE  [0207/7]
R90  56kΩ  RES-JKE  [0207/7]
TP23  MAP  TEST-POINT  [TP-P1-20]
TP24  MAP_FIL  TEST-POINT  [TP-P1-20]
TP25  O2  TEST-POINT  [TP-P1-20]
TP26  O2_FIL  TEST-POINT  [TP-P1-20]
TP27  TPS  TEST-POINT  [TP-P1-20]
TP28  TPS_FIL  TEST-POINT  [TP-P1-20]
U7  LM358  [SOP08]
U8  LM358  [SOP08]
U9  LM358  [SOP08]

### Nets
+5V: C14.1 C16.1 C18.1 R66.1 R71.1 R75.1 R80.1 R84.1 R89.1 U7.8(VDD) U8.8(VDD) U9.8(VDD) ; also sheet 1,2,3,4,5
GND: C9.2 C14.2 C16.2 C18.2 R39.1 R68.1 R72.1 R77.1 R81.1 R86.1 R90.1 U7.4(VSS) U8.4(VSS) U9.4(VSS) ; also sheet 1,2,3,4,5
MAP: C9.1 R20.1 R39.2 TP23.TP ; also sheet 1
MAP_FIL: C15.2 R70.1 TP24.TP U7.7(VOUTB) ; also sheet 1
N$53: R66.2 R67.2 U7.3(VINA+)
N$54: R71.2 R72.2 U7.5(VINB+)
N$55: R20.2 R21.2 U7.2(VINA-)
N$56: R21.1 R69.1 U7.1(VOUTA)
N$57: C15.1 R69.2 R70.2 U7.6(VINB-)
N$58: R67.1 R68.2
N$59: R75.2 R76.2 U8.3(VINA+)
N$60: R80.2 R81.2 U8.5(VINB+)
N$61: R73.2 R74.2 U8.2(VINA-)
N$62: R74.1 R78.1 U8.1(VOUTA)
N$63: C17.1 R78.2 R79.2 U8.6(VINB-)
N$64: R76.1 R77.2
N$65: R84.2 R85.2 U9.3(VINA+)
N$66: R89.2 R90.2 U9.5(VINB+)
N$67: R82.2 R83.2 U9.2(VINA-)
N$68: R83.1 R87.1 U9.1(VOUTA)
N$69: C19.1 R87.2 R88.2 U9.6(VINB-)
N$70: R85.1 R86.2
O2: R73.1 TP25.TP
O2_FIL: C17.2 R79.1 TP26.TP U8.7(VOUTB) ; also sheet 1
TPS: R82.1 TP27.TP ; also sheet 1
TPS_FIL: C19.2 R88.1 TP28.TP U9.7(VOUTB) ; also sheet 1

### Notes on the sheet
- MAP
- HIGH FREQ
  BLOCKER
- TPS
- O2
- Analog

## Library data of the parts
C1-C10 C13-C19 C33-C36 = cpsmv:CAP-JKE: Axial lead, through-hole, general purpose capacitor; DATASHEET_LINK: http://www.joeknowselectronics.com/index.php/products/component-kits/capacitor-kit.html; MANUFACTURER: joe Knows Electronics; MANUFACTURER_PN: n/a; PACKAGE: C050-025X075; SUPPLIER: Joe knows Electronics; SUPPLIER_PN: n/a
D1 = cpsmv:LTL-533-11: LED, thru-hole, R/A, green; DATASHEET_LINK: http://optoelectronics.liteon.com/upload/download/DS-20-92-0410/S_110_LTL-533-11.pdf; LED_COLOR: Green; MANUFACTURER: Lite-On; MANUFACTURER_PN: LTL-533-11; PACKAGE: Through-hole LED, R/A; SUPPLIER: Digi-Key; SUPPLIER_PN: 160-1977-ND
D2 D3 = cpsmv:LTL-553-11: LED, thru-hole, R/A, yellow; DATASHEET_LINK: http://optoelectronics.liteon.com/upload/download/DS-20-92-0410/S_110_LTL-533-11.pdf; LED_COLOR: Yellow; MANUFACTURER: Lite-On; MANUFACTURER_PN: LTL-553-11; PACKAGE: Through-hole LED, R/A; SUPPLIER: Digi-Key; SUPPLIER_PN: 160-1978-ND
D4 D5 = cpsmv:LTL-523-11: LED, thru-hole, R/A, red; DATASHEET_LINK: http://optoelectronics.liteon.com/upload/download/DS-20-92-0410/S_110_LTL-533-11.pdf; LED_COLOR: Red; MANUFACTURER: Lite-On; MANUFACTURER_PN: LTL-523-11; PACKAGE: Through-hole LED, R/A; SUPPLIER: Digi-Key; SUPPLIER_PN: 160-1976-ND
J1 = cpsmv:PINHD-1X10: PIN HEADER; DATASHEET_LINK: http://www.joeknowselectronics.com/index.php/products/headers.html; MANUFACTURER: Joe Knows Electronics; MANUFACTURER_PN: n/a; PACKAGE: 1X10 Header Pin; SUPPLIER: Joe Knows Electronics; SUPPLIER_PN: n/a
J2-J6 = cpsmv:PINHD-1X8: PIN HEADER; DATASHEET_LINK: http://www.joeknowselectronics.com/index.php/products/headers.html; MANUFACTURER: Joe Knows Electronics; MANUFACTURER_PN: n/a; PACKAGE: 1X8 Header Pin; SUPPLIER: Joe Knows Electronics; SUPPLIER_PN: n/a
J7 = cpsmv:AMPSEAL-23POS-HEADER: 23 position male header, wire-to-board, sealing connector; DATASHEET_LINK: http://www.te.com/commerce/DocumentDelivery/DDEController?Action=srchrtrv&DocNm=776087&DocType=Customer+Drawing&DocLang=English; MANUFACTURER: TE Connectivity; MANUFACTURER_PN: 776087-1; PACKAGE: AMPSEAL-HEADER-23POS-RA; SUPPLIER: Digi-Key; SUPPLIER_PN: A107007-ND
J8 = cpsmv:PINHD-2X3: PIN HEADER; DATASHEET_LINK: http://www.joeknowselectronics.com/index.php/products/headers.html; MANUFACTURER: Joe Knows Electronics; MANUFACTURER_PN: n/a; PACKAGE: 2X03 Header Pin; SUPPLIER: Joe Knows Electronics; SUPPLIER_PN: n/a
J9 J10 = cpsmv:MOLEX-85505-5002: RJ45 Connector, Through-hole, Shielded, Right-angle; DATASHEET_LINK: http://www.molex.com/pdm_docs/sd/855055002_sd.pdf; MANUFACTURER: Molx; MANUFACTURER_PN: 855055002; PACKAGE: RJ45, Thru-hole, Shielded, R/A; SUPPLIER: Digi-Key; SUPPLIER_PN: WM7131CT-ND
JP1-JP3 = cpsmv:PINHD-1X1: PIN HEADER; DATASHEET_LINK: http://www.joeknowselectronics.com/index.php/products/headers.html; MANUFACTURER: Joe Knows Electronics; MANUFACTURER_PN: n/a; PACKAGE: 1X1 Header Pin; SUPPLIER: Joe Knows Electronics; SUPPLIER_PN: n/a
Q1 Q3-Q6 = cpsmv:PN2222A: NPN TRANSISTOR; DATASHEET_LINK: https://www.fairchildsemi.com/datasheets/PN/PN2222A.pdf; MANUFACTURER: Fairchild; MANUFACTURER_PN: PN2222ABU; PACKAGE: TO92; SUPPLIER: Digi-Key; SUPPLIER_PN: PN2222AFS-ND
Q2 = cpsmv:FJPF13009: High current NPN transistor; DATASHEET_LINK: https://www.fairchildsemi.com/datasheets/FJ/FJPF13009.pdf; MANUFACTURER: Fairchild; MANUFACTURER_PN: FJPF13009H1TU; PACKAGE: TO220; SUPPLIER: Digi-Key; SUPPLIER_PN: FJPF13009H1TU-ND
Q7 = cpsmv:ISL9V5036P3_F085: Ignition coil IGBT; DATASHEET_LINK: https://www.fairchildsemi.com/datasheets/IS/ISL9V5036P_F085.pdf; MANUFACTURER: Fairchild; MANUFACTURER_PN: ISL9V5036P3_F085; PACKAGE: TO220AB; SUPPLIER: Digi-Key; SUPPLIER_PN: ISL9V5036P3_F085-ND
R1-R30 R33-R41 R64-R90 = cpsmv:RES-JKE: Axial-lead, through hole,1/4W, 1% tolerance, general-purpose resistors; DATASHEET_LINK: http://www.joeknowselectronics.com/index.php/products/component-kits/metal-film-resistor-kit.html; MANUFACTURER: Joe Knows Electronics; MANUFACTURER_PN: n/a; PACKAGE: 0207/7; SUPPLIER: Joe Knows Electronics; SUPPLIER_PN: n/a
R31 R32 = cpsmv:VISHAY_DALE-LVR03R0100FE70: Precision 0.1% tolerance current-sensing resistor. Axial-lead, 10mΩ; DATASHEET_LINK: http://www.vishay.com/docs/30206/lvr.pdf; MANUFACTURER: Vishay Dale; MANUFACTURER_PN: LVR03R0100FE70; PACKAGE: 14mm X 5.2mm axial; SUPPLIER: Digi-Key; SUPPLIER_PN: LVRB-.01RCT-ND
SW1 = cpsmv:CTS-204-211ST: DPST, SMD switch; DATASHEET_LINK: http://www.ctscorp.com/components/Datasheets/204.pdf; MANUFACTURER: CTS; MANUFACTURER_PN: 204-211ST; PACKAGE: SMD-4, Gull-Wing; SUPPLIER: Digi-Key; SUPPLIER_PN: CT204211ST-ND
TP1-TP8 TP10-TP28 TP36-TP39 TP44-TP51 = cpsmv:TEST-POINT: Thru-hole test point
U1 = cpsmv:TXS0104ED: 4-BIT BIDIRECTIONAL VOLTAGE-LEVEL TRANSLATOR FOR OPEN-DRAIN AND PUSH-PULL APPLICATIONS; DATASHEET_LINK: http://www.ti.com/lit/ds/symlink/txs0104e.pdf; MANUFACTURER: Texas Instruments; MANUFACTURER_PN: TXS0104EDR; PACKAGE: SOIC-14; SUPPLIER: Digi-Key; SUPPLIER_PN: 296-20696-1-ND
U2 U5 U7-U9 = cpsmv:LM358: Dual single-supply, general purpose op-amps; DATASHEET_LINK: http://www.ti.com/lit/ds/symlink/lm158-n.pdf; MANUFACTURER: Texas Instruments; MANUFACTURER_PN: LM3358; PACKAGE: 8-SOIC; SUPPLIER: Digi-Key; SUPPLIER_PN: 296-1014-2-ND
U10 = cpsmv:MCP2551-I/SN: High-Speed CAN Transceiver; DATASHEET_LINK: http://ww1.microchip.com/downloads/en/DeviceDoc/21667f.pdf; MANUFACTURER: Microchip; MANUFACTURER_PN: MCP2551-I/SN; PACKAGE: SOIC-8; SUPPLIER: Digi-Key; SUPPLIER_PN: MCP2551-I/SN-ND